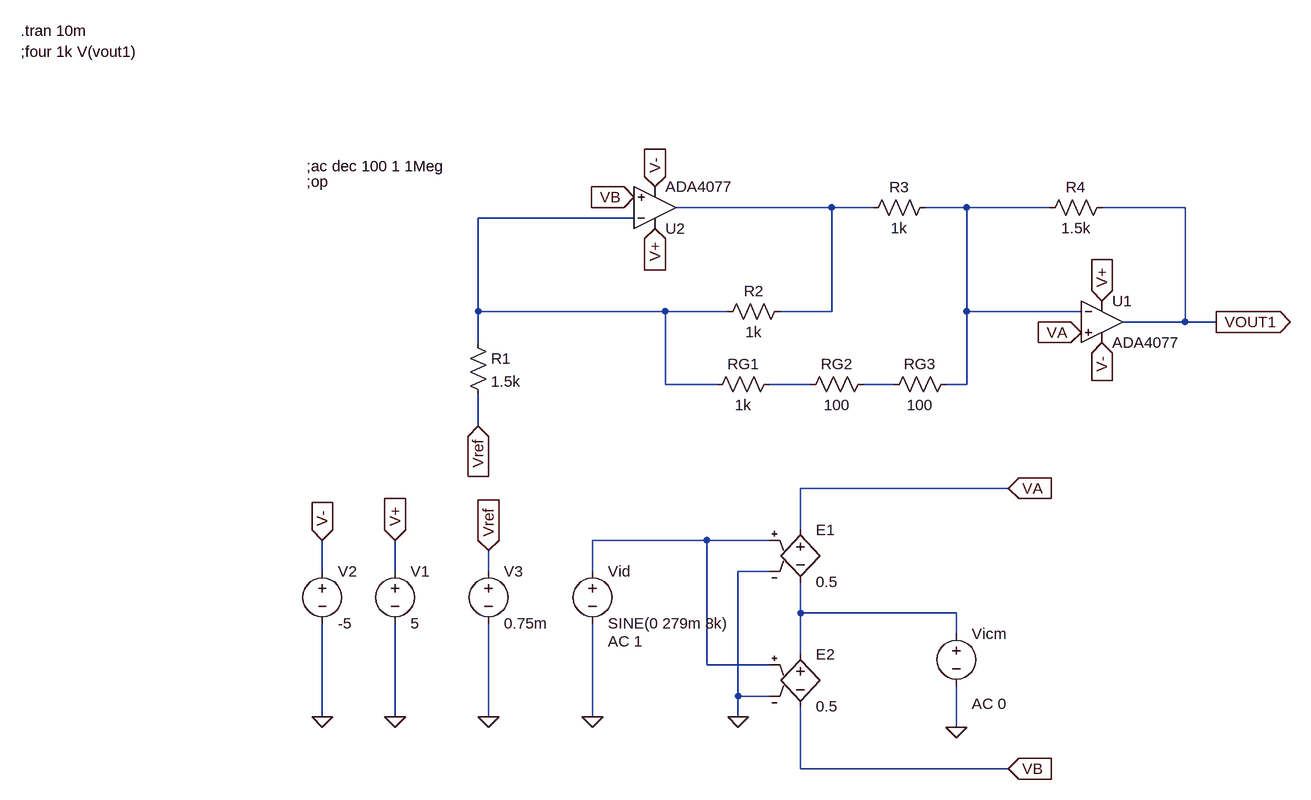
[diagram p0: schematic Etaj1.asc]
Etaj1.asc, the LTspice schematic file:
Version 4
SHEET 1 944 984
WIRE 80 48 -160 48
WIRE 144 48 80 48
WIRE 288 48 224 48
WIRE 416 48 288 48
WIRE 624 48 496 48
WIRE -224 64 -464 64
WIRE -464 208 -464 64
WIRE -176 208 -464 208
WIRE -80 208 -176 208
WIRE 80 208 80 48
WIRE 80 208 0 208
WIRE 288 208 288 48
WIRE 464 208 288 208
WIRE 624 224 624 48
WIRE 624 224 528 224
WIRE 672 224 624 224
WIRE -464 256 -464 208
WIRE -176 320 -176 208
WIRE -96 320 -176 320
WIRE 48 320 -16 320
WIRE 176 320 128 320
WIRE 288 320 288 208
WIRE 288 320 256 320
WIRE -464 384 -464 336
WIRE 352 480 32 480
WIRE 32 544 32 480
WIRE -112 560 -288 560
WIRE -16 560 -112 560
WIRE -704 608 -704 560
WIRE -592 608 -592 560
WIRE -448 608 -448 576
WIRE -288 608 -288 560
WIRE -16 608 -64 608
WIRE 32 672 32 624
WIRE 272 672 32 672
WIRE 272 704 272 672
WIRE 32 736 32 672
WIRE -112 752 -112 560
WIRE -16 752 -112 752
WIRE -64 800 -64 608
WIRE -16 800 -64 800
WIRE -704 832 -704 688
WIRE -592 832 -592 688
WIRE -448 832 -448 688
WIRE -288 832 -288 688
WIRE -64 832 -64 800
WIRE 272 848 272 784
WIRE 32 912 32 816
WIRE 352 912 32 912
FLAG -592 832 0
FLAG -704 832 0
FLAG -592 560 V+
IOPIN -592 560 In
FLAG -704 560 V-
IOPIN -704 560 In
FLAG 496 256 V-
IOPIN 496 256 In
FLAG -192 16 V-
IOPIN -192 16 In
FLAG 496 192 V+
IOPIN 496 192 In
FLAG -192 80 V+
IOPIN -192 80 In
FLAG 464 240 VA
IOPIN 464 240 In
FLAG -224 32 VB
IOPIN -224 32 In
FLAG 672 224 VOUT1
IOPIN 672 224 Out
FLAG -288 832 0
FLAG -64 832 0
FLAG 272 848 0
FLAG 352 480 VA
IOPIN 352 480 In
FLAG 352 912 VB
IOPIN 352 912 In
FLAG -448 576 Vref
IOPIN -448 576 In
FLAG -464 384 Vref
IOPIN -464 384 In
FLAG -448 832 0
DATAFLAG 624 224 ""
SYMBOL res -480 240 R0
SYMATTR InstName R1
SYMATTR Value 1.5k
SYMBOL res 16 192 R90
WINDOW 0 0 56 VBottom 2
WINDOW 3 32 56 VTop 2
SYMATTR InstName R2
SYMATTR Value 1k
SYMBOL res 240 32 R90
WINDOW 0 0 56 VBottom 2
WINDOW 3 32 56 VTop 2
SYMATTR InstName R3
SYMATTR Value 1k
SYMBOL res 512 32 R90
WINDOW 0 0 56 VBottom 2
WINDOW 3 32 56 VTop 2
SYMATTR InstName R4
SYMATTR Value 1.5k
SYMBOL res 0 304 R90
WINDOW 0 0 56 VBottom 2
WINDOW 3 32 56 VTop 2
SYMATTR InstName RG1
SYMATTR Value 1k
SYMBOL voltage -592 592 R0
WINDOW 123 24 44 Left 2
WINDOW 39 0 0 Left 0
SYMATTR InstName V1
SYMATTR Value 5
SYMBOL voltage -704 592 R0
WINDOW 123 24 44 Left 2
WINDOW 39 0 0 Left 0
SYMATTR InstName V2
SYMATTR Value -5
SYMBOL e 32 528 R0
SYMATTR InstName E1
SYMATTR Value 0.5
SYMBOL e 32 720 R0
SYMATTR InstName E2
SYMATTR Value 0.5
SYMBOL voltage 272 688 R0
WINDOW 123 24 124 Left 2
WINDOW 39 0 0 Left 0
SYMATTR Value2 AC 0
SYMATTR InstName Vicm
SYMATTR Value ""
SYMBOL voltage -288 592 R0
WINDOW 123 24 124 Left 2
WINDOW 39 0 0 Left 0
SYMATTR Value2 AC 1
SYMATTR InstName Vid
SYMATTR Value SINE(0 279m 8k)
SYMBOL voltage -448 592 R0
WINDOW 123 0 0 Left 0
WINDOW 39 0 0 Left 0
SYMATTR InstName V3
SYMATTR Value 0.75m
SYMBOL res 144 304 R90
WINDOW 0 0 56 VBottom 2
WINDOW 3 32 56 VTop 2
SYMATTR InstName RG2
SYMATTR Value 100
SYMBOL res 272 304 R90
WINDOW 0 0 56 VBottom 2
WINDOW 3 32 56 VTop 2
SYMATTR InstName RG3
SYMATTR Value 100
SYMBOL OpAmps\\ADA4077 496 160 R0
SYMATTR InstName U1
SYMBOL OpAmps\\ADA4077 -192 112 M180
SYMATTR InstName U2
TEXT -728 8 Left 2 !;op
TEXT -728 -16 Left 2 !;ac dec 100 1 1Meg
TEXT -1168 -224 Left 2 !.tran 10m
TEXT -1168 -192 Left 2 !;four 1k V(vout1)

The netlist it stands for:
* Etaj1.asc
R1 N003 Vref 1.5k
R2 N001 N003 1k
R3 N002 N001 1k
R4 VOUT1 N002 1.5k
RG1 N004 N003 1k
V1 V+ 0 5
V2 V- 0 -5
E1 VA N007 N006 0 0.5
E2 N007 VB N006 0 0.5
Vicm N007 0 AC 0
Vid N006 0 SINE(0 279m 8k) AC 1
V3 Vref 0 0.75m
RG2 N005 N004 100
RG3 N002 N005 100
XU1 VA N002 V+ V- VOUT1 ADA4077  ; pins In+ In- V+ V- OUT
XU2 VB N003 V+ V- N001 ADA4077  ; pins In+ In- V+ V- OUT
;op
;ac dec 100 1 1Meg
.tran 10m
;four 1k V(vout1)
.backanno
.end